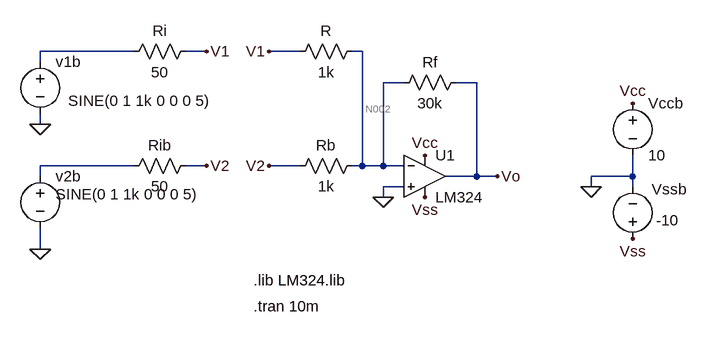
[diagram p0: schematic circuito1lab2sumador.asc]
circuito1lab2sumador.asc, the LTspice schematic file:
Version 4
SHEET 1 880 680
WIRE -272 -32 -416 -32
WIRE -160 -32 -192 -32
WIRE -16 -32 -64 -32
WIRE 80 -32 64 -32
WIRE -416 -16 -416 -32
WIRE 144 16 112 16
WIRE 256 16 224 16
WIRE -416 80 -416 64
WIRE -272 144 -416 144
WIRE -160 144 -192 144
WIRE -16 144 -64 144
WIRE 80 144 80 -32
WIRE 80 144 64 144
WIRE 112 144 112 16
WIRE 112 144 80 144
WIRE 144 144 112 144
WIRE -416 160 -416 144
WIRE 256 160 256 16
WIRE 256 160 208 160
WIRE 288 160 256 160
WIRE 496 160 496 128
WIRE 496 160 432 160
WIRE 144 176 112 176
WIRE 432 176 432 160
WIRE 496 176 496 160
WIRE 112 192 112 176
WIRE -416 272 -416 240
FLAG 176 192 Vss
FLAG 176 128 Vcc
FLAG -64 -32 V1
FLAG -64 144 V2
FLAG 288 160 Vo
FLAG -416 80 0
FLAG -416 272 0
FLAG -160 -32 V1
FLAG -160 144 V2
FLAG 432 176 0
FLAG 496 48 Vcc
FLAG 496 256 Vss
FLAG 112 192 0
SYMBOL OpAmps\\opamp2 176 96 R0
SYMATTR InstName U1
SYMATTR Value LM324
SYMBOL res 240 0 R90
WINDOW 0 0 56 VBottom 2
WINDOW 3 32 56 VTop 2
SYMATTR InstName Rf
SYMATTR Value 30k
SYMBOL res 80 128 R90
WINDOW 0 0 56 VBottom 2
WINDOW 3 32 56 VTop 2
SYMATTR InstName Rb
SYMATTR Value 1k
SYMBOL res 80 -48 R90
WINDOW 0 0 56 VBottom 2
WINDOW 3 32 56 VTop 2
SYMATTR InstName R
SYMATTR Value 1k
SYMBOL res -176 -48 R90
WINDOW 0 0 56 VBottom 2
WINDOW 3 32 56 VTop 2
SYMATTR InstName Ri
SYMATTR Value 50
SYMBOL res -176 128 R90
WINDOW 0 0 56 VBottom 2
WINDOW 3 32 56 VTop 2
SYMATTR InstName Rib
SYMATTR Value 50
SYMBOL voltage -416 -32 R0
WINDOW 123 49 100 Left 2
WINDOW 39 0 0 Left 0
WINDOW 3 43 76 Left 2
SYMATTR InstName v1b
SYMATTR Value SINE(0 1 1k 0 0 0 5)
SYMBOL voltage -416 144 R0
WINDOW 123 24 72 Left 2
WINDOW 39 0 0 Left 0
WINDOW 3 24 44 Left 2
SYMATTR InstName v2b
SYMATTR Value SINE(0 1 1k 0 0 0 5)
SYMBOL voltage 496 32 R0
WINDOW 123 0 0 Left 0
WINDOW 39 0 0 Left 0
SYMATTR InstName Vccb
SYMATTR Value 10
SYMBOL voltage 496 272 R180
WINDOW 123 0 0 Left 0
WINDOW 39 0 0 Left 0
WINDOW 0 -83 92 Left 2
WINDOW 3 -72 44 Left 2
SYMATTR InstName Vssb
SYMATTR Value -10
TEXT -88 320 Left 2 !.lib LM324.lib
TEXT -88 360 Left 2 !.tran 10m

The netlist it stands for:
* circuito1lab2sumador.asc
XU1 0 N002 Vcc Vss Vo LM324  ; pins In+ In- V+ V- OUT
Rf Vo N002 30k
Rb N002 V2 1k
R N002 V1 1k
Ri V1 N001 50
Rib V2 N003 50
v1b N001 0 SINE(0 1 1k 0 0 0 5)
v2b N003 0 SINE(0 1 1k 0 0 0 5)
Vccb Vcc 0 10
Vssb Vss 0 -10
.lib LM324.lib
.tran 10m
.backanno
.end

* Results of the author's LTspice run, read from the files saved beside the schematic
* Operating Point, zero values left out:
*   V(vo) = -2.554 mV
*   V(vss) = -10 V
*   V(vcc) = 10 V
*   V(n002) = -33.63 µV
*   V(v2) = -1.601 µV
*   V(v1) = -1.601 µV
*   I(Rib) = -32.03 nA
*   I(Ri) = -32.03 nA
*   I(R) = -32.03 nA
*   I(Rb) = -32.03 nA
*   I(Rf) = -84 nA
*   I(Vssb) = 669.8 µA
*   I(Vccb) = -669.9 µA
*   I(V2b) = -32.03 nA
*   I(V1b) = -32.03 nA
*   Ix(u1:1) = -19.92 nA
*   Ix(u1:2) = -19.94 nA
*   Ix(u1:3) = 669.9 µA
*   Ix(u1:4) = -669.8 µA
*   Ix(u1:5) = 84 nA
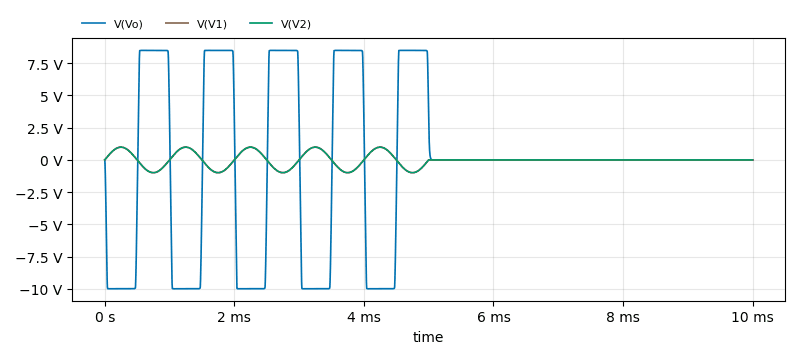
[diagram p1: Transient Analysis of circuito1lab2sumador.asc, plotted from the saved traces]
* Transient Analysis, 1 run:
*   V(Vo): min -9.999 V, max 8.499 V, average -338.5 mV, rms 6.303 V, last -2.554 mV
*   V(V1): min -991.2 mV, max 990 mV, average -256.2 µV, rms 494.1 mV, last -1.601 µV
*   V(V2): min -991.2 mV, max 990 mV, average -256.2 µV, rms 494.1 mV, last -1.601 µV